# EAGLE design MAPE-CUN-Large-018 (EAGLE 7.3.0)
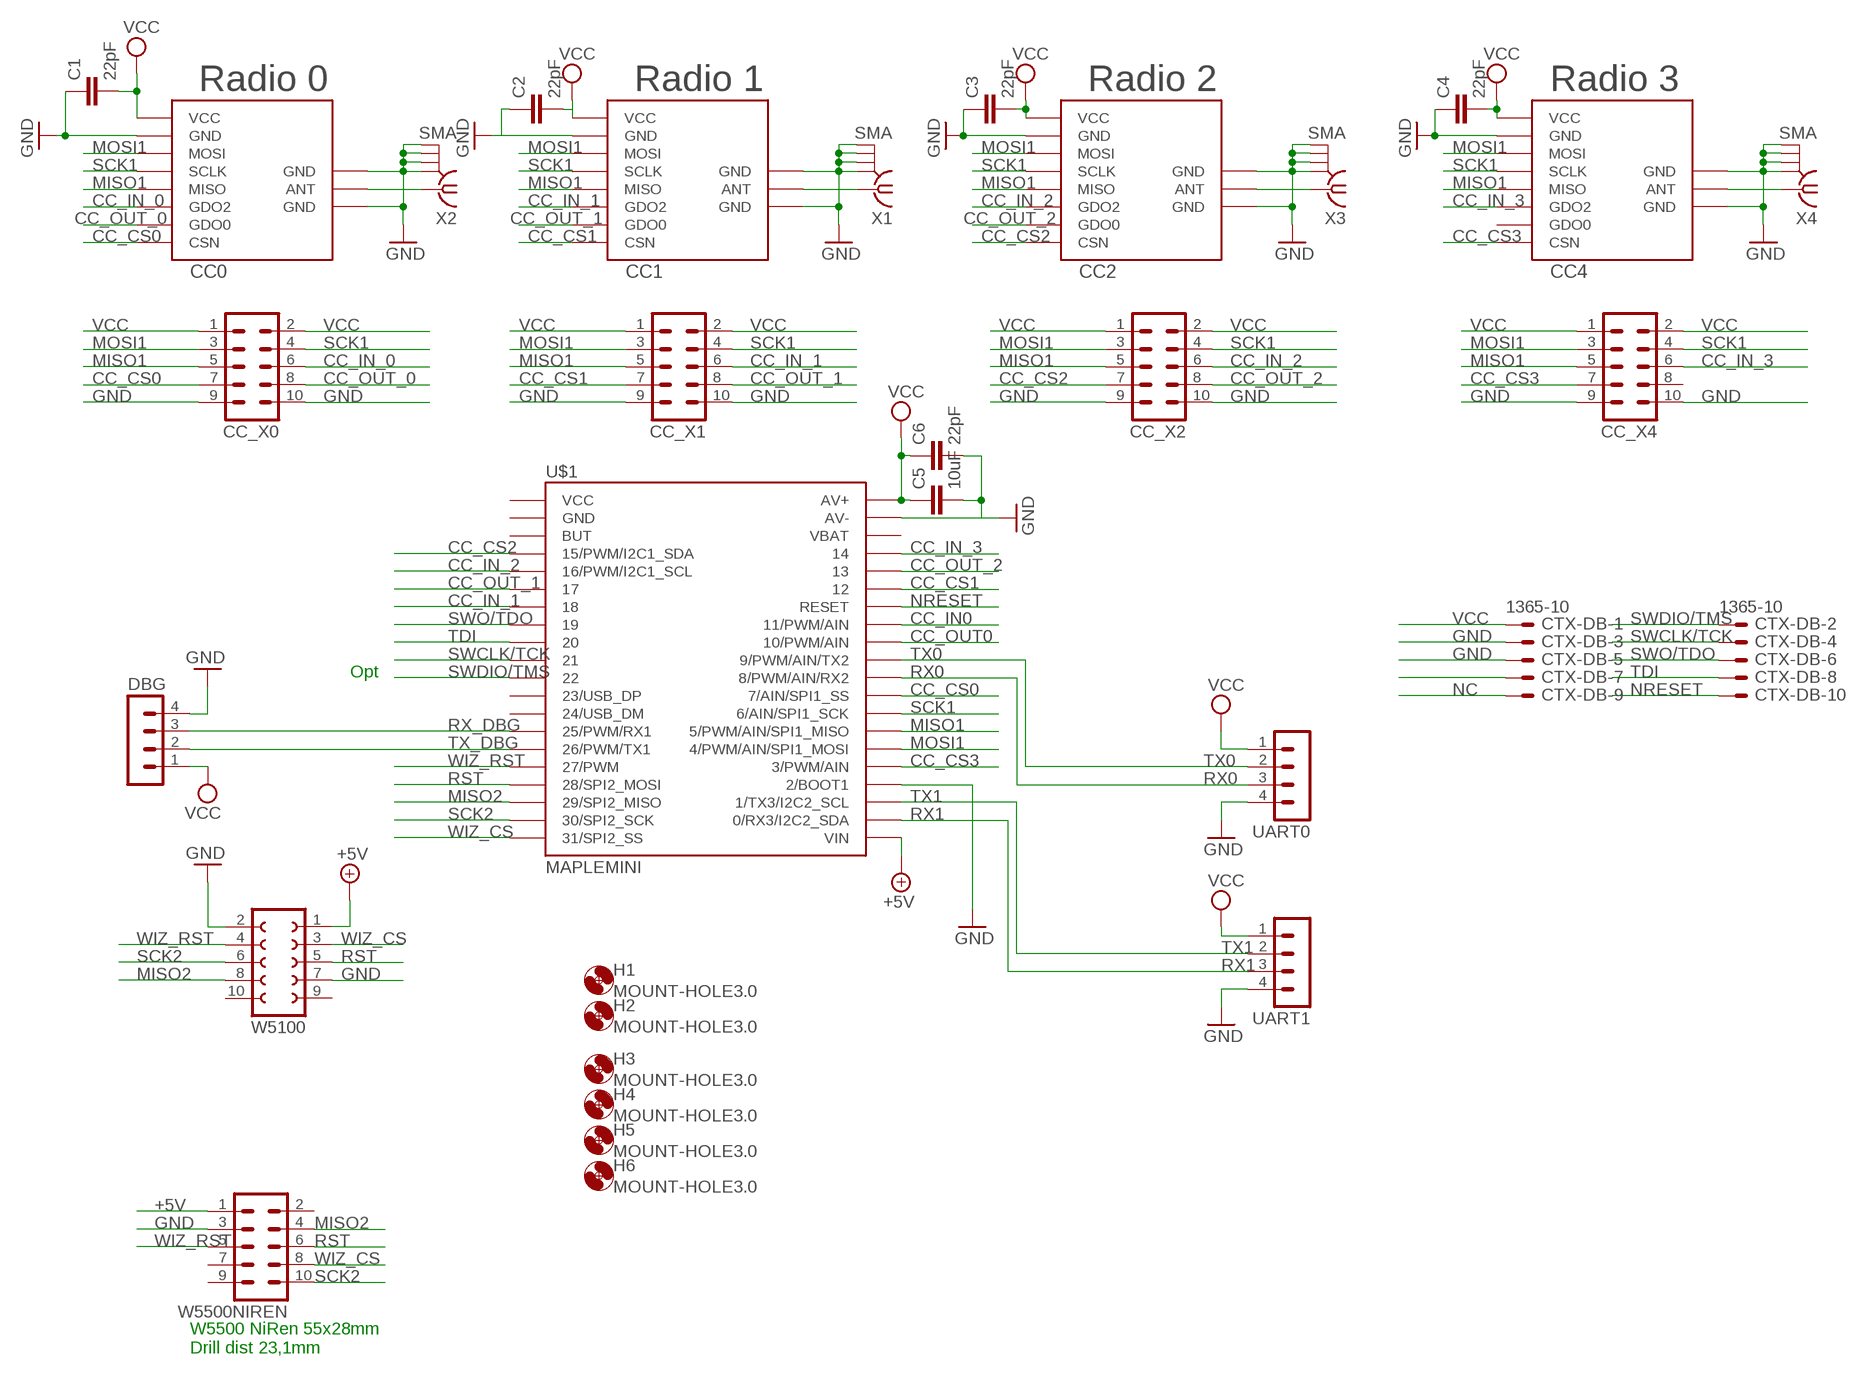
[diagram p0: schematic, sheet 1]

## Parts
C1  22pF  C-EUC0805  [C0805]
C2  22pF  C-EUC0805  [C0805]
C3  22pF  C-EUC0805  [C0805]
C4  22pF  C-EUC0805  [C0805]
C5  10uF  C-EUC1210  [C1210]
C6  22pF  C-EUC0805  [C0805]
CC0  CC1101_MODULE1SMD  [CC1101_MODULE1_SMD]
CC1  CC1101_MODULE1SMD  [CC1101_MODULE1_SMD]
CC2  CC1101_MODULE1SMD  [CC1101_MODULE1_SMD]
CC4  CC1101_MODULE1SMD  [CC1101_MODULE1_SMD]
CC_X0  MA05-2  [MA05-2]
CC_X1  MA05-2  [MA05-2]
CC_X2  MA05-2  [MA05-2]
CC_X4  MA05-2  [MA05-2]
CTX-DB  1365-10  [1365-10]
DBG  MA04-1  [MA04-1]
H1  MOUNT-HOLE3.0  [3,0]
H2  MOUNT-HOLE3.0  [3,0]
H3  MOUNT-HOLE3.0  [3,0]
H4  MOUNT-HOLE3.0  [3,0]
H5  MOUNT-HOLE3.0  [3,0]
H6  MOUNT-HOLE3.0  [3,0]
U$1  MAPLEMINI  [20-DIP]
UART0  MA04-1  [MA04-1]
UART1  MA04-1  [MA04-1]
W5100  FE05-2  [FE05-2]
W5500NIREN  MA05-2  [MA05-2]
X1  SMA  [SMA]
X2  SMA  [SMA]
X3  SMA  [SMA]
X4  SMA  [SMA]

## Nets
+5V: U$1.21(VIN) W5100.1 W5500NIREN.1
CC_CS0: CC0.CSN CC_X0.7 U$1.29(7/AIN/SPI1_SS)
CC_CS1: CC1.CSN CC_X1.7 U$1.35
CC_CS2: CC2.CSN CC_X2.7 U$1.4(15/PWM/I2C1_SDA)
CC_CS3: CC4.CSN CC_X4.7 U$1.25(3/PWM/AIN)
CC_IN0: U$1.33(11/PWM/AIN)
CC_IN_0: CC0.GDO2 CC_X0.6
CC_IN_1: CC1.GDO2 CC_X1.6 U$1.7
CC_IN_2: CC2.GDO2 CC_X2.6 U$1.5(16/PWM/I2C1_SCL)
CC_IN_3: CC4.GDO2 CC_X4.6 U$1.37
CC_OUT0: U$1.32(10/PWM/AIN)
CC_OUT_0: CC0.GDO0 CC_X0.8
CC_OUT_1: CC1.GDO0 CC_X1.8 U$1.6
CC_OUT_2: CC2.GDO0 CC_X2.8 U$1.36
GND: C1.1 C2.1 C3.1 C4.1 C5.2 C6.2 CC0.GND@0(GND) CC0.GND@1(GND) CC0.GND@2(GND) CC1.GND@0(GND) CC1.GND@1(GND) CC1.GND@2(GND) CC2.GND@0(GND) CC2.GND@1(GND) CC2.GND@2(GND) CC4.GND@0(GND) CC4.GND@1(GND) CC4.GND@2(GND) CC_X0.9 CC_X0.10 CC_X1.9 CC_X1.10 CC_X2.9 CC_X2.10 CC_X4.9 CC_X4.10 CTX-DB.3 CTX-DB.5 DBG.4 U$1.24(2/BOOT1) U$1.39(AV-) UART0.4 UART1.4 W5100.2 W5100.7 W5500NIREN.3 X1.GND@1 X1.GND@2 X1.GND@3 X1.GND@4 X2.GND@1 X2.GND@2 X2.GND@3 X2.GND@4 X3.GND@1 X3.GND@2 X3.GND@3 X3.GND@4 X4.GND@1 X4.GND@2 X4.GND@3 X4.GND@4
MISO1: CC0.MISO CC1.MISO CC2.MISO CC4.MISO CC_X0.5 CC_X1.5 CC_X2.5 CC_X4.5 U$1.27(5/PWM/AIN/SPI1_MISO)
MISO2: U$1.18(29/SPI2_MISO) W5100.8 W5500NIREN.4
MOSI1: CC0.MOSI CC1.MOSI CC2.MOSI CC4.MOSI CC_X0.3 CC_X1.3 CC_X2.3 CC_X4.3 U$1.26(4/PWM/AIN/SPI1_MOSI)
N$1: CC2.ANT X3.1
N$2: CC4.ANT X4.1
N$3: CC1.ANT X1.1
N$4: CC0.ANT X2.1
N$8: CTX-DB.7
NC: CTX-DB.9
NRESET: CTX-DB.10 U$1.34(RESET)
RST: U$1.17(28/SPI2_MOSI) W5100.5 W5500NIREN.6
RX0: U$1.30(8/PWM/AIN/RX2) UART0.3
RX1: U$1.22(0/RX3/I2C2_SDA) UART1.3
RX_DBG: DBG.3 U$1.14(25/PWM/RX1)
SCK1: CC0.SCLK CC1.SCLK CC2.SCLK CC4.SCLK CC_X0.4 CC_X1.4 CC_X2.4 CC_X4.4 U$1.28(6/AIN/SPI1_SCK)
SCK2: U$1.19(30/SPI2_SCK) W5100.6 W5500NIREN.10
SWCLK/TCK: CTX-DB.4 U$1.10
SWDIO/TMS: CTX-DB.2 U$1.11
SWO/TDO: CTX-DB.6 U$1.8
TDI: CTX-DB.8 U$1.9
TX0: U$1.31(9/PWM/AIN/TX2) UART0.2
TX1: U$1.23(1/TX3/I2C2_SCL) UART1.2
TX_DBG: DBG.2 U$1.15(26/PWM/TX1)
VCC: C1.2 C2.2 C3.2 C4.2 C5.1 C6.1 CC0.VCC CC1.VCC CC2.VCC CC4.VCC CC_X0.1 CC_X0.2 CC_X1.1 CC_X1.2 CC_X2.1 CC_X2.2 CC_X4.1 CC_X4.2 CTX-DB.1 DBG.1 U$1.40(AV+) UART0.1 UART1.1
WIZ_CS: U$1.20(31/SPI2_SS) W5100.3 W5500NIREN.8
WIZ_RST: U$1.16(27/PWM) W5100.4 W5500NIREN.5
Unconnected: CC4.GDO0 CC_X4.8 U$1.1(VCC) U$1.2(GND) U$1.3(BUT) U$1.12(23/USB_DP) U$1.13(24/USB_DM) U$1.38(VBAT) W5100.9 W5100.10 W5500NIREN.2 W5500NIREN.7 W5500NIREN.9

## Notes on the sheet
- Radio 0 | Radio 1 | Radio 2 | Radio 3
- Opt
- W5500 NiRen 55x28mm
  Drill dist 23,1mm

## Library data of the parts
C1-C6 = rcl:C-EU: CAPACITOR, European symbol
CC0 CC1 CC2 CC4 = wireless:CC1101_MODULE1: CC1101 wireless module for 433/868 MHz (sold from Aliexpress). DIL version for mounting with pin header (and SMD soldering) and SMD only variant available.
CC_X0 CC_X1 CC_X2 CC_X4 W5500NIREN = con-lstb:MA05-2: PIN HEADER; OC_FARNELL: unknown; OC_NEWARK: unknown
CTX-DB = con-leotronics:1365-10: DUAL ROW STRAIGHT HEADER 1364 SERIES. 1.27mm x 1.27mm. Without Fixing Post. SMT Source: http://www.leotronics.co.uk/Conexcon/Data%20Sheets/sec.%20A/1364ing.pdf; OC_FARNELL: unknown; OC_NEWARK: unknown
DBG UART0 UART1 = con-lstb:MA04-1: PIN HEADER; OC_FARNELL: unknown; OC_NEWARK: unknown
H1-H6 = holes:MOUNT-HOLE: MOUNTING HOLE with drill center marker
U$1 = maplemini-small:MAPLEMINI
W5100 = con-lsta:FE05-2: FEMALE HEADER; OC_FARNELL: unknown; OC_NEWARK: unknown
X1-X4 = sma:SMA: SMA 50 Ohm end launch jack receptacle - round contact

## Net classes
0 default: width 0.406 mm
1 PWR: width 0.305 mm

## Board
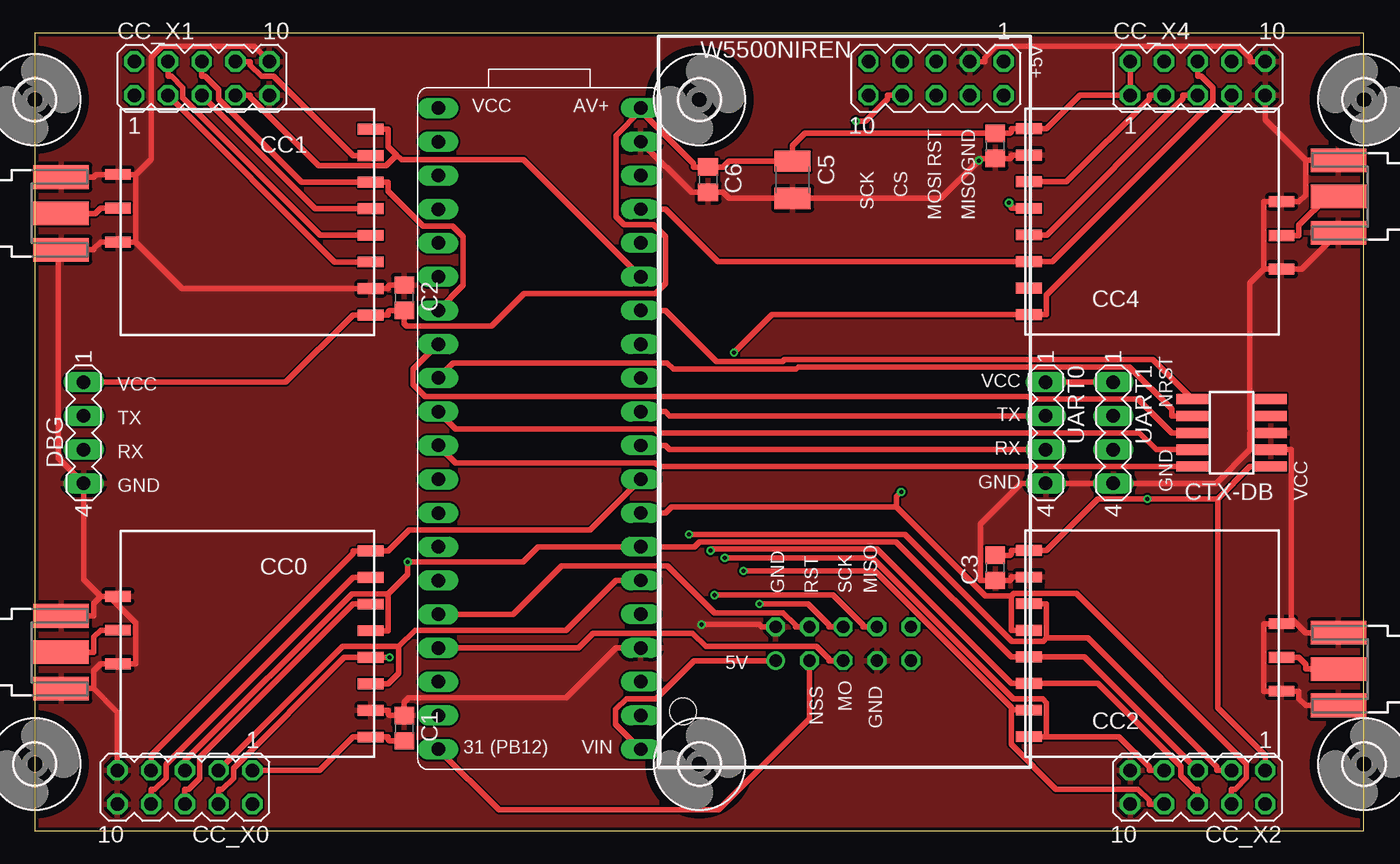
[diagram p1: board, top side]
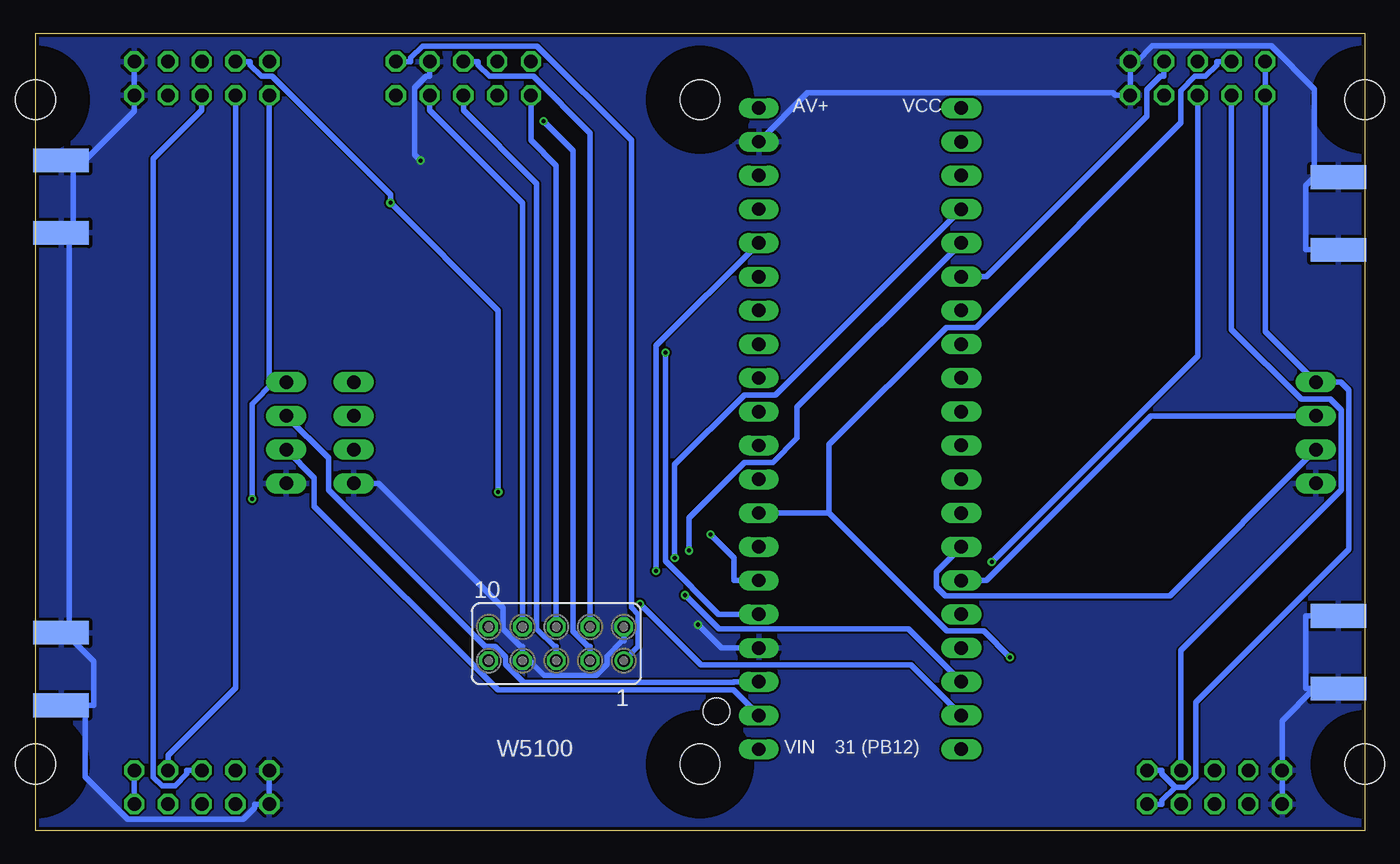
[diagram p2: board, bottom side, seen from below]

Size 100 x 60 mm. Coordinates in mm from the lower left corner, seen from the top.
Outline: 0,60 0,0 100,0 100,60 0,60
Copper layers (1*16): Top 0.035mm / dielectric 1.5mm / Bottom 0.035mm
Design rules "SeeedStudio_2layer_DRU_no_angle_20140221": minimum track width 6mil, minimum drill 12mil, track to track 6mil, track to pad 6mil, pad to pad 6mil, via to via 6mil, smd to smd 0mil, copper to edge 10mil, drill to drill 10mil, minimum pad ring 10mil, minimum via ring 6mil, stop-mask expansion 2mil, vias tented up to drill 100mil, thermal gap 10mil
Holes 2 mm at 48.76,8.97

### Footprints (pad centres in the part's own frame; a part is rotated, then mirrored left to right if it is on the bottom)
C0805 = smd 1.3 x 1.5: 1 -0.95,0; 2 0.95,0
C1210 = smd 1.6 x 2.7: 1 -1.4,0; 2 1.4,0
CC1101_MODULE1_SMD = smd 1.93 x 0.813: ANT 19,5.96; CSN 0,0; GDO0 0,2; GDO2 0,4; GND@0 0,12; GND@1 19,8.5; GND@2 19,3.42; MISO 0,6; MOSI 0,10; SCLK 0,8; VCC 0,14
MA05-2 = drill 1.016 octagon: 1 -5.08,-1.27; 2 -5.08,1.27; 3 -2.54,-1.27; 4 -2.54,1.27; 5 0,-1.27; 6 0,1.27; 7 2.54,-1.27; 8 2.54,1.27; 9 5.08,-1.27; 10 5.08,1.27
1365-10 = smd 0.76 x 2.4: 1 -2.54,-2.95; 2 -2.54,2.95; 3 -1.27,-2.95; 4 -1.27,2.95; 5 0,-2.95; 6 0,2.95; 7 1.27,-2.95; 8 1.27,2.95; 9 2.54,-2.95; 10 2.54,2.95
MA04-1 = drill 1.016 long: 1 -3.81,0; 2 -1.27,0; 3 1.27,0; 4 3.81,0
3,0 = hole 3: 0,0
20-DIP = drill 1.016 pad 1.27 long: 1 -24.13,-7.62; 2 -21.59,-7.62; 3 -19.05,-7.62; 4 -16.51,-7.62; 5 -13.97,-7.62; 6 -11.43,-7.62; 7 -8.89,-7.62; 8 -6.35,-7.62; 9 -3.81,-7.62; 10 -1.27,-7.62; 11 1.27,-7.62; 12 3.81,-7.62; 13 6.35,-7.62; 14 8.89,-7.62; 15 11.43,-7.62; 16 13.97,-7.62; 17 16.51,-7.62; 18 19.05,-7.62; 19 21.59,-7.62; 20 24.13,-7.62 | drill 1 pad 1.27 long: 21 24.13,7.62; 22 21.59,7.62; 23 19.05,7.62; 24 16.51,7.62; 25 13.97,7.62; 26 11.43,7.62; 27 8.89,7.62; 28 6.35,7.62; 29 3.81,7.62; 30 1.27,7.62; 31 -1.27,7.62; 32 -3.81,7.62; 33 -6.35,7.62; 34 -8.89,7.62; 35 -11.43,7.62; 36 -13.97,7.62; 37 -16.51,7.62; 38 -19.05,7.62; 39 -21.59,7.62; 40 -24.13,7.62
FE05-2 = drill 0.914: 1 -5.08,1.27 | drill 0.914 octagon: 2 -5.08,-1.27; 3 -2.54,1.27; 4 -2.54,-1.27; 5 0,1.27; 6 0,-1.27; 7 2.54,1.27; 8 2.54,-1.27; 9 5.08,1.27; 10 5.08,-1.27
SMA = smd 4.191 x 1.778: 1 2.115,0; GND@1 2.115,2.733; GND@2 2.115,-2.733 | smd 4.191 x 1.778 bottom: GND@3 2.115,2.733; GND@4 2.115,-2.733

### Placement (x,y rotation side)
C1  27.8,7.71 270 top
C2  27.8,40.09 270 top
C3  72.25,19.77 90 top
C4  72.25,51.52 90 top
C5  57.01,48.98 270 top
C6  50.66,48.98 270 top
CC0  25.26,21.04 180 top
CC1  25.26,52.79 180 top
CC2  74.79,7.07 0 top
CC4  74.79,38.82 0 top
CC_X0  11.29,3.26 180 top
CC_X1  12.56,56.6 0 top
CC_X2  87.49,3.26 180 top
CC_X4  87.49,56.6 0 top
CTX-DB  90.03,29.93 90 top
DBG  3.67,29.93 270 top
H1  100,5 0 top
H2  100,55 90 top
H3  0,5 0 top
H4  0,55 0 top
H5  50,5 0 top
H6  50,55 0 top
U$1  37.96,30.25 270 top
UART0  76.06,29.93 270 top
UART1  81.14,29.93 270 top
W5100  60.82,14.05 180 bottom
W5500NIREN  67.8,56.6 180 top
X1  -0.14,46.44 0 top
X2  -0.14,13.42 0 top
X3  100.19,12.15 180 top
X4  100.19,47.71 180 top

### Tracks (layer width: path | path; a pad name or v marks a point on that pad's centre or on a via)
+5V
  Top 0.406: W5100.1 49.58,12.79 46.72,9.93 44.51,9.93 43.69,9.1 43.69,8.01 U$1.21
  Bottom 0.406: W5100.1 54.67,13.85 54.67,16.28 55.17,16.78 55.17,51.95 62.26,59.03 70.89,59.03 71.77,58.15 71.77,57.87 W5500NIREN.1
CC_CS0
  Top 0.406: U$1.29 41.77,22.63 28.17,22.63 26.58,21.04 CC0.CSN 23.94,21.04 23.94,20.84 8.75,5.65 CC_X0.7
CC_CS1
  Top 0.406: 27.23,50.82 27.58,50.47 36.79,50.47 U$1.35 | 27.23,50.82 26.43,50.03 21.36,50.03 16.22,55.17 16.22,55.33 CC_X1.7 | 27.23,50.82 26.58,51.47 26.58,52.79 CC1.CSN
CC_CS2  (via drill 0.3 pad 0.61)
  Top 0.406: CC_X2.7 83.83,4.53 83.83,4.81 81.57,7.07 76.11,7.07 | CC2.CSN 76.11,7.07 | v51.91,20.52 63.01,20.52 73.61,9.91 75.83,9.91 76.11,9.63 76.11,7.07
  Bottom 0.406: U$1.4 44.31,32.79 46.66,32.79 51.91,27.54 v51.91,20.52
CC_CS3  (via drill 0.3 pad 0.61)
  Top 0.406: v52.6,35.98 55.44,38.82 CC4.CSN 76.11,38.82 76.11,40.29 90.03,54.21 CC_X4.7
  Bottom 0.406: U$1.25 48.6,16.28 52.6,20.28 v52.6,35.98
CC_IN_0
  Top 0.406: CC0.GDO2 23.94,17.04 12.41,5.51 12.41,3.95 11.57,3.11 11.29,3.11 CC_X0.6
CC_IN_1
  Top 0.406: U$1.7 32.23,41.03 32.23,44.68 31.42,45.49 29.22,45.49 26.58,48.12 26.58,48.79 CC1.GDO2 20.06,48.79 13.83,55.02 13.83,55.76 12.83,56.75 12.56,56.75 CC_X1.6
CC_IN_2  (via drill 0.3 pad 0.61)
  Top 0.406: v50.84,21.06 50.95,21.18 63.36,21.18 73.47,11.07 CC2.GDO2 79.99,11.07 86.22,4.84 86.22,4.1 87.22,3.11 87.49,3.11 CC_X2.6
  Bottom 0.406: U$1.5 42.69,31.86 42.69,29.52 44.51,27.71 46.64,27.71 50.84,23.51 v50.84,21.06
CC_IN_3
  Top 0.406: U$1.37 47.44,46.76 51.38,42.82 73.47,42.82 CC4.GDO2 76.57,42.82 88.62,54.88 88.62,55.89 87.76,56.75 87.49,56.75 CC_X4.6
CC_OUT_0
  Top 0.406: CC0.GDO0 23.94,19.04 9.87,4.97 9.87,3.95 9.03,3.11 8.75,3.11 CC_X0.8
CC_OUT_1
  Top 0.406: CC_X1.8 16.22,57.87 16.22,57.6 17.06,56.75 17.98,56.75 23.94,50.79 CC1.GDO0
  Bottom 0.406: CC_X1.8 15.1,56.75 15.37,56.75 16.37,55.76 16.37,53.77 28.46,41.68 U$1.6
CC_OUT_2  (via drill 0.3 pad 0.61)
  Top 0.406: 73.47,9.07 73.47,9.26 63.19,19.55 v53.31,19.55 | CC2.GDO0 73.47,9.07 | 73.47,9.07 73.47,6.47 76.83,3.11 82.99,3.11 83.83,2.27 83.83,1.99 CC_X2.8
  Bottom 0.406: U$1.36 53.31,36.49 v53.31,19.55
GND  (via drill 0.3 pad 0.61)
  Top 0.406: 28.13,9.99 39.97,9.99 43.72,13.74 U$1.24 | 28.13,9.99 | 28.13,9.99 27.8,9.66 C1.1 26.69,8.65 26.58,8.77 26.58,9.04 CC0.GND@0 | W5100.2 54.67,15.32 54.5,15.5 v50.15,15.5 | 7.58,49.37 7.58,44.29 | 7.58,49.37 CC1.GND@2 4.62,49.37 4.43,49.17 X1.GND@3 | CC_X1.10 16.49,59.02 9.58,59.02 8.75,58.19 8.75,50.54 7.58,49.37 | 94.94,15.57 95.62,14.88 X3.GND@4 | 94.94,15.57 94.54,15.97 94.54,28.66 CTX-DB.3 91.42,28.66 | 94.94,15.57 CC2.GND@1 92.47,15.57 92.47,10.49 CC2.GND@2 95.11,10.49 95.11,9.93 95.62,9.42 X3.GND@3 | 91.42,28.66 88.88,26.12 83.02,26.12 UART1.4 UART0.4 74.18,26.12 71.14,23.08 71.14,18.82 C3.1 73.36,18.82 73.47,18.93 73.47,19.07 CC2.GND@0 | 91.42,28.66 91.42,29.93 91.75,29.93 | W5500NIREN.3 71.46,57.87 71.46,58.14 72.32,59 90.6,59 91.45,58.15 91.45,57.87 CC_X4.10 | CTX-DB.5 91.75,29.93 | 92.47,42.24 91.42,41.2 91.42,30.25 91.75,29.93 | 92.47,42.24 92.61,42.24 CC4.GND@2 95.34,42.24 X4.GND@3 | 7.58,44.29 6.92,44.29 CC1.GND@1 4.94,44.29 4.43,43.78 4.43,43.71 X1.GND@4 1.75,43.48 1.75,28.04 DBG.4 3.67,18.89 4.94,17.62 | 7.58,44.29 | 7.58,44.29 11.08,40.79 CC1.GND@0 26.58,40.79 26.58,40.93 26.69,41.04 C2.1 | U$1.39 49.39,48.03 C6.2 51.77,48.03 52.22,47.58 C5.2 68.18,47.58 v71.03,50.43 71.14,50.55 71.14,50.57 C4.1 73.36,50.57 73.47,50.68 73.47,50.82 CC4.GND@0 | 5.6,17.62 7.58,15.64 7.58,12.54 CC0.GND@1 4.94,12.54 4.43,12.03 4.43,10.69 | 5.6,17.62 4.94,17.62 | CC0.GND@2 5.6,17.62 | 92.47,42.24 92.47,47.32 CC4.GND@1 95.11,47.32 95.62,47.83 95.62,50.44 | CC_X0.9 6.21,8.9 4.43,10.69 | CC_X4.9 92.57,53.5 95.62,50.44 | X2.GND@3 4.43,16.15 4.43,17.11 4.94,17.62 | X2.GND@4 4.43,10.69
  Top 0.406: X4.GND@4 95.62,50.44
  Bottom 0.406: v50.15,15.5 48.39,13.74 U$1.24 | W5100.2 55.74,14.26 55.87,14.26 57.01,13.12 57.01,12.52 57.83,11.7 61.74,11.7 63.36,13.32 | 63.36,13.32 63.36,13.85 63.49,13.85 64.83,15.19 64.83,16.77 74.18,26.12 UART0.4 | W5100.7 63.36,13.32 | 3.77,49.17 3.77,55.78 7.04,59.05 15.97,59.05 17.14,57.87 | 3.77,49.17 4.43,48.52 4.43,43.71 X1.GND@4 | 3.77,49.17 2.9,49.17 X1.GND@3 | 96.25,9.42 96.25,4.05 93.07,0.87 84.38,0.87 83.53,1.72 83.53,1.99 CC_X2.10 CC_X2.9 | 96.25,9.42 95.62,9.42 95.62,12.74 97.77,14.88 | X3.GND@3 96.25,9.42 | 97.77,14.88 97.46,14.88 97.46,44.37 96.85,44.98 97.16,44.98 | X3.GND@4 97.77,14.88 | X4.GND@3 97.16,44.98 | 97.16,50.44 96.25,50.44 92.57,54.12 CC_X4.9 CC_X4.10 | X4.GND@4 97.16,50.44 | 97.16,50.44 97.16,44.98 | 17.14,57.87 17.64,57.38 CC_X1.9 18.76,55.33 18.94,55.51 41.91,55.51 U$1.39 | CC_X1.10 17.14,57.87 | 3.77,10.69 6.21,8.25 CC_X0.9 CC_X0.10 | 3.77,10.69 4.43,10.69 4.43,16.15 X2.GND@3 | X2.GND@4 3.77,10.69 | W5500NIREN.3 70.34,56.75 70.62,56.75 71.46,55.91 71.46,50.87 v71.03,50.43
  pour Bottom: -0.14,59.78 -0.14,0.08 100.19,0.08 100.19,59.78
  pour Top: -0.14,0.08 -0.14,59.78 100.19,59.78 100.19,0.08
MISO1  (via drill 0.3 pad 0.61)
  Top 0.406: 26.58,17.8 28.06,19.28 v28.06,20.21 36.72,20.21 37.86,21.36 U$1.27 47.44,21.36 49.62,21.36 50,21.74 64.8,21.74 73.47,13.07 CC2.MISO 78.95,13.07 CC_X2.5 | CC_X0.5 11.29,5.24 23.86,17.8 26.58,17.8 | 26.58,17.8 26.58,15.04 CC0.MISO | CC_X1.5 21.1,46.79 CC1.MISO | CC_X4.5 86.37,55.33 86.37,55.06 76.14,44.82 CC4.MISO
  Bottom 0.406: CC_X1.5 12.56,35.72 v28.06,20.21 | CC_X2.5 88.61,4.53 88.61,4.26 89.51,3.35 90.48,3.35 91.15,4.02 91.15,50.55 87.49,54.21 CC_X4.5
MISO2  (via drill 0.3 pad 0.61)
  Top 0.406: v51.14,17.71 60.04,17.71 62.29,15.46 62.29,15.32 W5100.8
  Bottom 0.406: U$1.18 34.31,15.17 48.59,15.17 v51.14,17.71 | W5100.8 63.36,47.23 70.34,54.21 W5500NIREN.4
MOSI1  (via drill 0.3 pad 0.61)
  Top 0.406: CC_X4.3 83.83,55.33 83.83,55.05 77.6,48.82 CC4.MOSI | U$1.26 43.72,18.82 39.97,15.07 28.61,15.07 27.38,13.85 | 76.11,14.5 75.87,14.25 73.5,14.25 65.45,22.29 v49.23,22.29 | 76.11,14.5 79.22,14.5 88.91,4.8 88.91,4.53 CC_X2.3 | 76.11,14.5 76.11,17.07 CC2.MOSI | CC0.MOSI 26.58,11.04 27.38,11.84 27.38,13.85 | CC_X1.3 22.56,42.79 CC1.MOSI | CC_X0.3 23.15,13.85 27.38,13.85
  Bottom 0.406: v49.23,22.29 47.44,20.51 47.44,18.82 U$1.26 | CC_X0.3 13.83,13.56 1.76,25.63 1.76,31.65 2.57,32.47 4.78,32.47 10.02,37.72 CC_X1.3 | CC_X2.3 90.03,5.65 84.95,10.73 CC_X4.3
N$1
  Top 0.406: X3.1 95.62,12.15 95.62,12.52 95.11,13.03 CC2.ANT
N$2
  Top 0.406: CC4.ANT 95.11,44.78 95.11,45.54 97.28,47.71 X4.1
N$3
  Top 0.406: CC1.ANT 4.94,46.83 4.55,46.44 X1.1
N$4
  Top 0.406: X2.1 4.43,13.42 4.43,14.57 4.94,15.08 CC0.ANT
NRESET
  Top 0.406: CTX-DB.10 84.1,35.45 56.41,35.45 56.26,35.29 51.29,35.29 47.44,39.14 U$1.34
RST
  Top 0.406: W5100.5 59.75,12.79 59.75,12.92 58.82,13.85 50.48,13.85 49.48,14.85 42.01,14.85 40.89,13.74 U$1.17
  Bottom 0.406: W5100.5 60.82,13.85 60.95,13.85 62.29,15.19 62.29,48.7 67.8,54.21 W5500NIREN.6
RX0
  Top 0.406: U$1.30 47.44,28.98 47.76,28.66 UART0.3
RX1
  Bottom 0.406: UART1.3 79.02,26.54 79.02,24.39 65.22,10.58 47.5,10.58 U$1.22
RX_DBG
  Bottom 0.406: U$1.14 32.23,19.47 32.23,18.33 31.56,17.66 14.67,17.66 DBG.3
SCK1  (via drill 0.3 pad 0.61)
  Top 0.406: 64.83,24.34 71.5,17.66 73.47,17.66 | 64.83,24.34 47.88,24.34 47.44,23.9 U$1.28 | 64.83,24.34 64.83,25.13 v65.18,25.48 | CC4.SCLK 73.47,46.82 73.47,47.07 v73.3,47.24 | CC_X2.4 90.03,3.11 90.31,3.11 91.16,3.96 91.16,5.02 78.34,17.83 73.64,17.83 73.47,17.66 | 73.47,17.66 73.47,15.07 CC2.SCLK | v26.7,13.04 26.58,13.04 CC0.SCLK 23.29,13.04 14.95,4.7 14.95,3.95 14.11,3.11 13.83,3.11 CC_X0.4 | CC_X1.4 10.02,56.75 10.3,56.75 11.14,55.91 11.14,55.14 21.48,44.79 CC1.SCLK
  Bottom 0.406: CC_X4.4 83.83,57.87 83.83,57.59 82.99,56.75 82.2,56.75 73.3,47.85 v73.3,47.24 65.18,39.12 v65.18,25.48 | 40.3,23.9 31.41,15.01 28.66,15.01 v26.7,13.04 | 40.3,23.9 40.3,29.03 31.47,37.87 29.21,37.87 13.83,53.25 13.83,55.69 12.76,56.75 11.98,56.75 11.14,57.59 11.14,57.87 CC_X1.4 | 40.3,23.9 U$1.28
SCK2  (via drill 0.3 pad 0.61)
  Top 0.406: W5100.6 59.75,15.32 59.75,15.46 58.16,17.05 v54.51,17.05
  Bottom 0.406: v54.51,17.05 49.93,12.47 34.15,12.47 U$1.19 | W5500NIREN.10 62.73,51.93 60.82,50.03 W5100.6
SWCLK/TCK
  Top 0.406: U$1.10 31.65,30.2 46.68,30.2 46.95,29.93 83.11,29.93 84.38,28.66 CTX-DB.4
SWDIO/TMS
  Top 0.406: U$1.11 31.65,27.66 46.68,27.66 46.95,27.39 CTX-DB.2
SWO/TDO
  Top 0.406: U$1.8 28.46,34.72 28.46,33.57 29.36,32.67 74.73,32.67 74.92,32.47 82.98,32.47 85.52,29.93 CTX-DB.6
TDI
  Top 0.406: CTX-DB.8 85.52,31.2 85.52,31.71 82.35,34.89 57.44,34.89 57.26,34.72 48.05,34.72 47.58,35.2 31.48,35.2 U$1.9
TX0
  Top 0.406: U$1.31 47.44,31.52 47.76,31.2 UART0.2
TX1
  Bottom 0.406: UART1.2 77.96,28.02 77.96,25.62 66.19,13.85 65.42,13.85 64.63,13.06 64.63,12.49 63.27,11.14 47.5,11.14 47.44,11.2 U$1.23
TX_DBG
  Bottom 0.406: U$1.15 28.46,18.82 16.08,31.2 DBG.2
VCC  (via drill 0.3 pad 0.61)
  Top 0.406: CC_X0.1 21.43,4.53 23.94,7.04 CC0.VCC 26.58,7.04 26.58,6.87 26.69,6.75 C1.2 | 88.98,24.95 91.42,27.39 CTX-DB.1 | 88.98,24.95 v83.7,24.95 79.99,24.95 76.11,21.07 CC2.VCC 73.47,21.07 73.47,20.83 73.36,20.72 C3.2 | 88.98,24.95 88.98,9.23 92.57,5.65 CC_X2.1 | 45.59,54.17 43.72,52.3 43.72,46.21 44.33,45.6 46.54,45.6 47.45,44.69 47.45,41.15 46.7,40.41 36.82,40.41 34.36,37.95 27.98,37.95 27.8,38.13 C2.2 26.69,39.14 26.58,39.03 26.58,38.79 CC1.VCC 23.94,38.79 18.89,33.74 DBG.1 | U$1.40 45.59,54.17 | 45.59,54.17 49.55,50.2 49.55,49.93 C6.1 51.77,49.93 52.22,50.38 C5.1 57.01,51.54 57.94,52.47 C4.2 73.36,52.47 73.47,52.58 73.47,52.82 CC4.VCC 76.11,52.82 78.62,55.33 CC_X4.1 82.41,56.75 CC_X4.2 | UART1.1 UART0.1
  Bottom 0.406: 82.08,33.74 83.7,32.11 v83.7,24.95 | 82.08,33.74 82.41,34.07 CC_X4.1 | UART1.1 82.08,33.74 | 14.26,3.26 15.25,2.26 15.25,1.99 CC_X0.2 | 14.26,3.26 13.47,3.26 12.71,4.02 12.71,9.65 1.2,21.17 1.2,33.15 1.79,33.74 DBG.1 7.48,37.55 CC_X1.1 CC_X1.2 | 14.26,3.26 15.25,4.26 15.25,4.53 CC_X0.1 | CC_X2.2 CC_X2.1
WIZ_CS  (via drill 0.3 pad 0.61)
  Top 0.406: v61.77,53.38 62.47,53.38 64.15,55.05 64.15,55.33 W5500NIREN.8 | W5100.3 58.28,8.39 51.43,1.55 34.91,1.55 U$1.20
  Bottom 0.406: v61.77,53.38 59.55,51.15 59.55,14.99 58.41,13.85 58.28,13.85 W5100.3
WIZ_RST
  Top 0.406: U$1.16 35.96,16.28 39.62,19.93 47.61,19.93 51.15,16.39 56.28,16.39 57.21,15.46 57.21,15.32 W5100.4
  Bottom 0.406: W5500NIREN.5 66.69,57.87 66.69,57.59 65.85,56.75 62.54,56.75 58.28,52.5 W5100.4

### Text on the board
tNames: +5V | VCC | AV+ | RST | GND | SCK | CS | MOSI | MISO | VCC | VCC | TX | NRST | TX | RX | RX | GND | GND | GND | VCC | GND | RST | SCK | MISO | 5V | NSS | GND | MO | 31 (PB12) | VIN
bNames: VCC | AV+ | 31 (PB12) | VIN